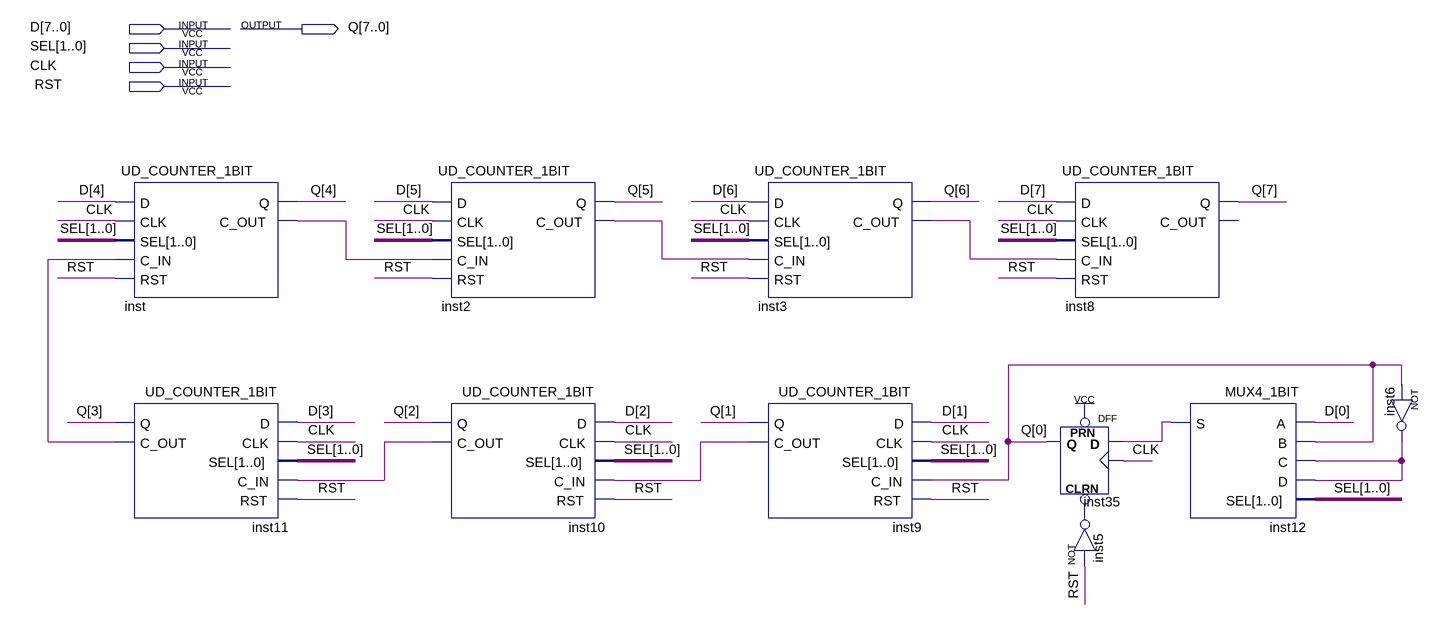
[diagram p0: schematic sheet]
// Quartus schematic UD_COUNTER_8BIT.bdf as structural Verilog: 11 symbols, 5 pins
module UD_COUNTER_8BIT (
  input  [7:0] D,
  input  [1:0] SEL,
  input  CLK,
  input  RST,
  output [7:0] Q
);

  wire inst2_c_out, inst3_c_out, inst5_out, inst6_out, inst9_c_out, inst10_c_out, inst11_c_out, inst12_s,
       inst_c_out;

  UD_COUNTER_1BIT inst (.D(D[4]), .CLK(CLK), .SEL(SEL), .C_IN(inst11_c_out), .RST(RST), .Q(Q[4]), .C_OUT(inst_c_out));
  UD_COUNTER_1BIT inst11 (
    .D(D[3]), .CLK(CLK), .SEL(SEL), .C_IN(inst10_c_out), .RST(RST), .Q(Q[3]), .C_OUT(inst11_c_out));
  UD_COUNTER_1BIT inst2 (.D(D[5]), .CLK(CLK), .SEL(SEL), .C_IN(inst_c_out), .RST(RST), .Q(Q[5]), .C_OUT(inst2_c_out));
  UD_COUNTER_1BIT inst10 (
    .D(D[2]), .CLK(CLK), .SEL(SEL), .C_IN(inst9_c_out), .RST(RST), .Q(Q[2]), .C_OUT(inst10_c_out));
  UD_COUNTER_1BIT inst3 (.D(D[6]), .CLK(CLK), .SEL(SEL), .C_IN(inst2_c_out), .RST(RST), .Q(Q[6]), .C_OUT(inst3_c_out));
  UD_COUNTER_1BIT inst9 (.D(D[1]), .CLK(CLK), .SEL(SEL), .C_IN(Q[0]), .RST(RST), .Q(Q[1]), .C_OUT(inst9_c_out));
  DFF inst35 (.CLRN(inst5_out), .CLK(CLK), .D(inst12_s), .PRN(1'b1), .Q(Q[0]));
  UD_COUNTER_1BIT inst8 (.D(D[7]), .CLK(CLK), .SEL(SEL), .C_IN(inst3_c_out), .RST(RST), .Q(Q[7]));  // open: C_OUT
  not inst5 (inst5_out, RST);
  MUX4_1BIT inst12 (.A(D[0]), .B(Q[0]), .C(inst6_out), .D(inst6_out), .SEL(SEL), .S(inst12_s));
  not inst6 (inst6_out, Q[0]);
endmodule
